# Altium schematic sheet RBB_MCU7_V2.2_Top.SchDoc: <Project Name>
size A4; ApprovedBy: <Appr.>; Author: <Author>; CompanyName: Infineon Technologies AG; Engineer: <Rel.>; Organization: Infineon Technologies AG; Address1: IFAG DES S PS; Address2: Am Campeon 1-12  -  85579 Neubiberg  -  Germany; Address3: 85579 Neubiberg; Address4: Germany; Revision: <Rev.>; SheetNumber: 2; SheetTotal: 4; Release: RC00; PageSetup: Record=PageOptions|CenterHorizontal=True|CenterVertical=True|PrintScale=1.01|XCorrection=1.00|YCorrection=1.00|PrintKind=0|BorderSize=5000000|LeftOffset=0|BottomOffset=0|Orientation=2|PaperLength=1000|PaperWidth=1000|Scale=100|PaperSource=7|PrintQuality=-4|MediaType=1|DitherType=10|PaperKind=A3|PrintScaleMode=1; Doc_ConfidentialStatus: <Doc_ConfidentialStatus>; Doc_Preliminary: <Doc_Preliminary>
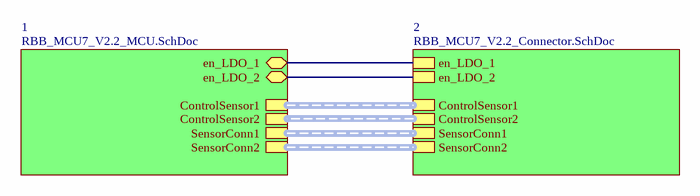
[diagram p0: RBB_MCU7_V2.2_Top.SchDoc]

## Sub-sheets
1 = RBB_MCU7_V2.2_MCU.SchDoc: en_LDO_1 (bidir), en_LDO_2 (bidir), SensorConn2 (harness SensorConn2), SensorConn1 (harness SensorConn1), ControlSensor1 (harness ControlSensor1), ControlSensor2 (harness ControlSensor2)
2 = RBB_MCU7_V2.2_Connector.SchDoc: en_LDO_1, en_LDO_2, SensorConn1 (harness SensorConn1), SensorConn2 (harness SensorConn2), ControlSensor1 (harness ControlSensor1), ControlSensor2 (harness ControlSensor2)

## Nets
(unnamed): sheet 1/en_LDO_1, sheet 2/en_LDO_1
(unnamed): sheet 1/en_LDO_2, sheet 2/en_LDO_2

## Buses and harness runs
harness sheet 1/ControlSensor1 = sheet 2/ControlSensor1
harness sheet 1/ControlSensor2 = sheet 2/ControlSensor2
harness sheet 1/SensorConn1 = sheet 2/SensorConn1
harness sheet 1/SensorConn2 = sheet 2/SensorConn2

## Notes on the sheet
- Title
- Variant
- Approved
- Date:
- Author:
- Size:
- A4
- Document Name
- Time:
- SVN Revision:
- Rel.
- Rev.
- Sheet
- of